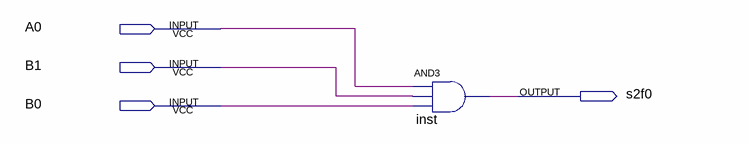
[diagram p0: schematic sheet]
// Quartus schematic s2f0.bdf as structural Verilog: 1 symbols, 4 pins
module s2f0 (
  input  A0,
  input  B1,
  input  B0,
  output s2f0
);

  and inst (s2f0, A0, B1, B0);
endmodule
